# EAGLE design OOBD - BTM182 - V3 (EAGLE 5.11)
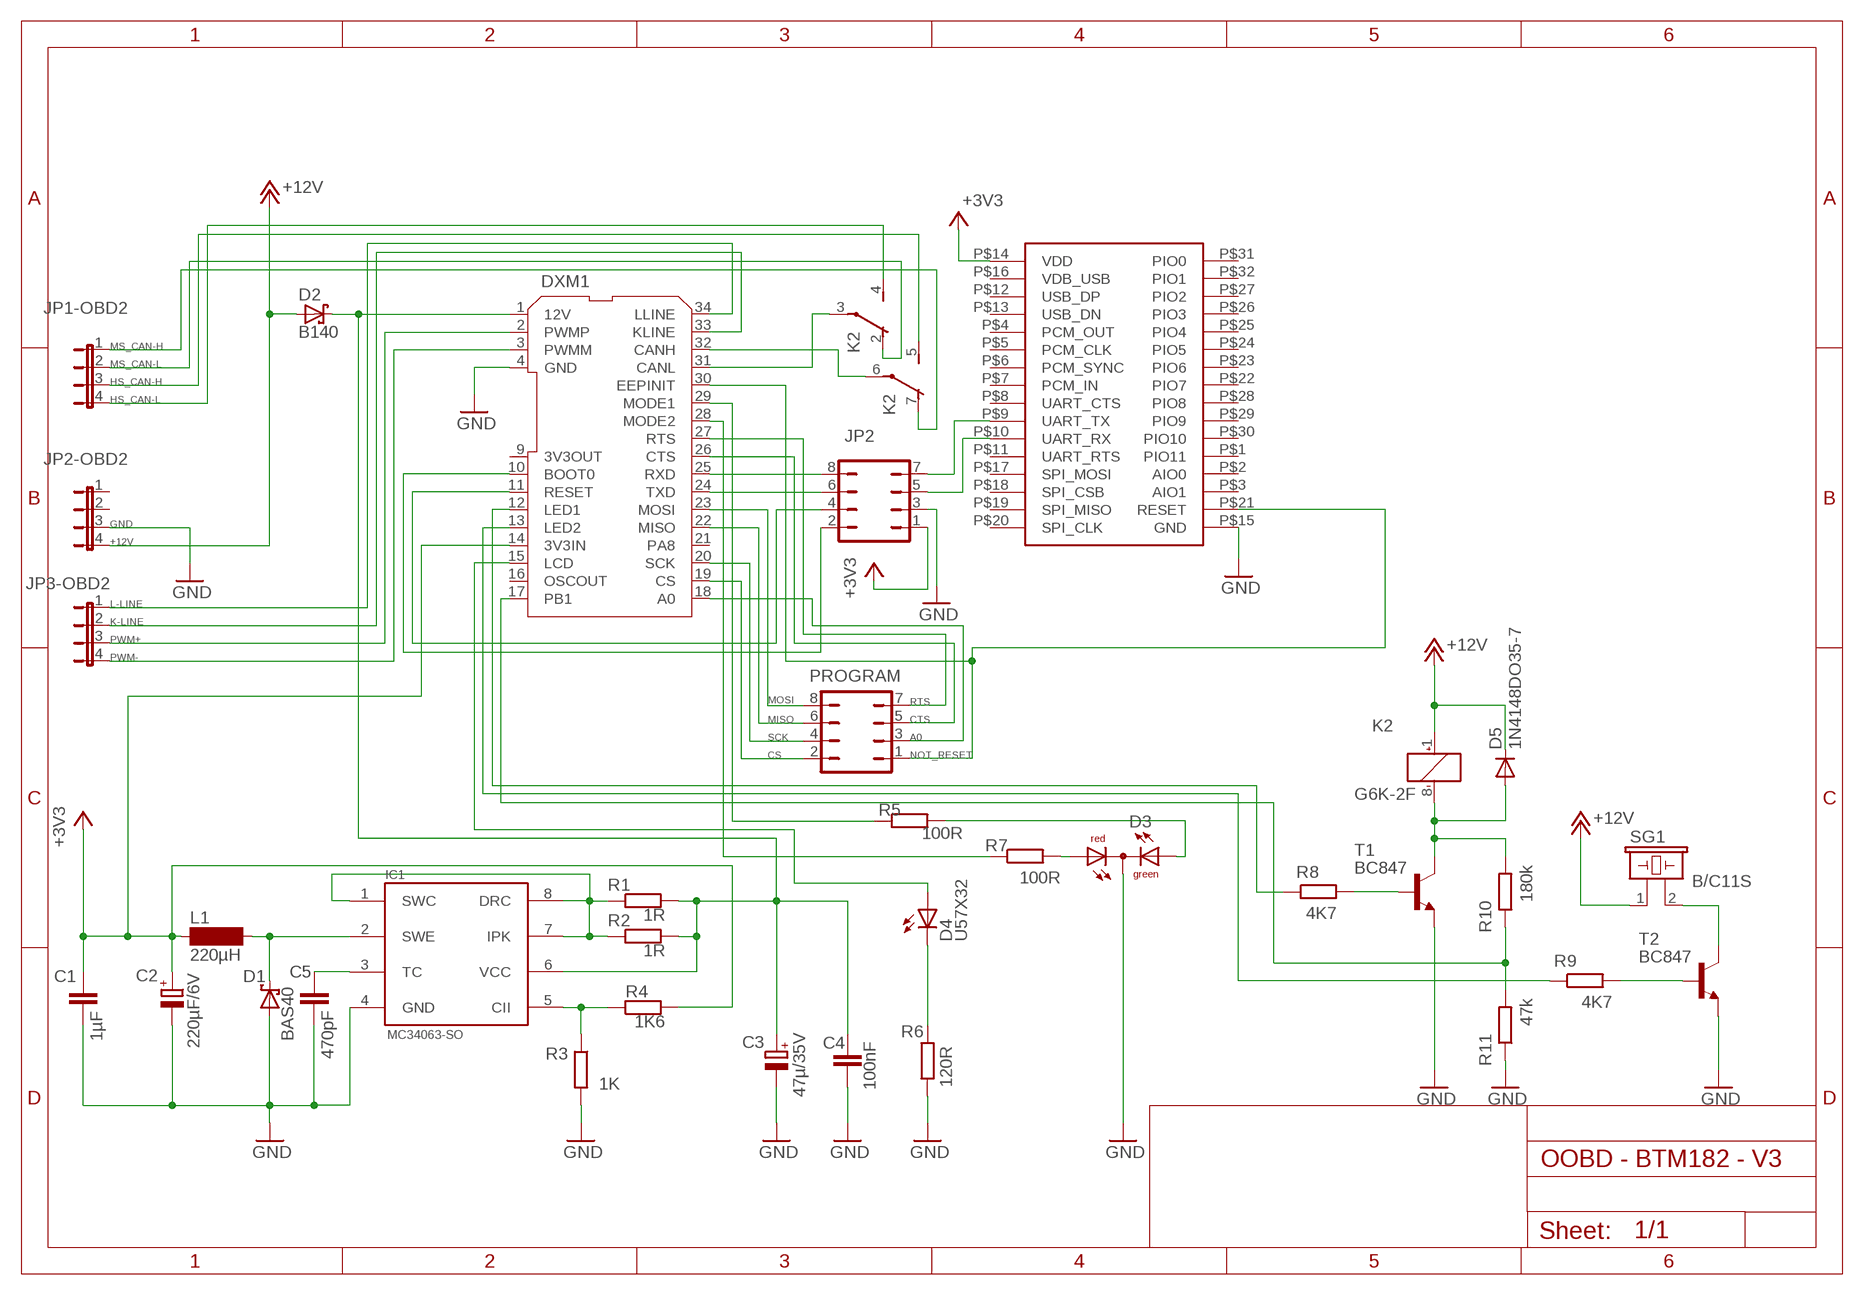
[diagram p0: schematic, sheet 1]

## Parts
BTM182  Bluetooth1  BTM182  [BTM182]
C1  1µF  C-EUC0603K  [C0603K]
C2  220µF/6V  CPOL-EUA/3216-18R  [A/3216-18R]
C3  47µ/35V  CPOL-EUA/3216-18R  [A/3216-18R]
C4  100nF  C-EUC0603K  [C0603K]
C5  470pF  C-EUC0603K  [C0603K]
D1  BAS40  [SOT23]
D2  B140  SCHOTTKY-DIODESMD  [SMB]
D3  DUOLED2X5  [DUOLED2X5]
D4  U57X32  LEDSQR5.7X3.2  [U57X32]
D5  1N4148DO35-7  DIODE-MICROMELF-W  [MICROMELF-W]
DXM1  DXM1-MINI  [DMX1-MINI]
IC1  MC34063-SO  [SO8]
JP1-OBD2  JP4E  [JP4]
JP2  JP4Q  [JP4Q]
JP2-OBD2  JP4E  [JP4]
JP3-OBD2  JP4E  [JP4]
K2  G6K-2F  [G6K-2F]
L1  220µH  SM-NE45  [SM-NE45]
PROGRAM  JP4Q  [JP4Q]
R1  1R  R-EU_R0603  [R0603]
R2  1R  R-EU_R0603  [R0603]
R3  1K  R-EU_R0603  [R0603]
R4  1K6  R-EU_R0603  [R0603]
R5  100R  R-EU_R0603  [R0603]
R6  120R  R-EU_R0603  [R0603]
R7  100R  R-EU_R0603  [R0603]
R8  4K7  R-EU_R0603  [R0603]
R9  4K7  R-EU_R0603  [R0603]
R10  180k  R-EU_R0603  [R0603]
R11  47k  R-EU_R0603  [R0603]
SG1  B/C11S  [B/C11S]
T1  BC847  [SOT23]
T2  BC847  [SOT23]

## Nets
+3V3: BTM182.P$14(VDD) C1.1 C2.+ DXM1.14(3V3IN) JP2.1 L1.1 R4.2
+12V: D2.A D5.C JP2-OBD2.4 K2.1(1:+) SG1.1
A0: DXM1.18(A0) PROGRAM.3
CS: DXM1.19(CS) PROGRAM.2
CTS: DXM1.26(CTS) PROGRAM.5
GND: BTM182.P$15(GND) C1.2 C2.- C3.- C4.2 C5.2 D1.1(A) D3.K(C) DXM1.4(GND) IC1.4(GND) JP2-OBD2.3 JP2.3 R3.2 R6.2 R11.1 T1.2(E) T2.2(E)
HS_CAN-H: JP1-OBD2.3 K2.5(3:S)
HS_CAN-L: JP1-OBD2.4 K2.4(2:S)
K-LINE: DXM1.33(KLINE) JP3-OBD2.2
L-LINE: DXM1.34(LLINE) JP3-OBD2.1
MISO: DXM1.22(MISO) PROGRAM.6
MOSI: DXM1.23(MOSI) PROGRAM.8
MS_CAN-H: JP1-OBD2.1 K2.7(3:O)
MS_CAN-L: JP1-OBD2.2 K2.2(2:O)
N$1: IC1.5(CII) R3.1 R4.1
N$2: C5.1 IC1.3(TC)
N$4: D3.AR R7.2
N$5: IC1.1(SWC) IC1.7(IPK) IC1.8(DRC) R1.1 R2.1
N$6: D3.AG R5.2
N$7: D4.K(C) R6.1
N$8: D4.A DXM1.15(LCD)
N$9: DXM1.29(MODE1) R5.1
N$10: DXM1.25(RXD) JP2.8
N$11: C3.+ C4.1 D2.C DXM1.1(12V) IC1.6(VCC) R1.2 R2.2
N$12: DXM1.24(TXD) JP2.6
N$14: BTM182.P$9(UART_TX) JP2.7
N$15: DXM1.28(MODE2) R7.1
N$16: DXM1.10(BOOT0) JP2.2
N$17: DXM1.11(RESET) JP2.4
N$19: DXM1.17(PB1) R10.1 R11.2
N$20: R8.2 T1.1(B)
N$21: DXM1.32(CANH) K2.6(3:P)
N$22: DXM1.31(CANL) K2.3(2:P)
N$23: SG1.2 T2.3(C)
N$24: R9.2 T2.1(B)
N$25: DXM1.12(LED1) R8.1
N$26: DXM1.13(LED2) R9.1
N$27: D5.A K2.8(1:-) R10.2 T1.3(C)
N$28: BTM182.P$10(UART_RX) JP2.5
N$29: D1.3(C) IC1.2(SWE) L1.2
NOT_RESET: BTM182.P$21(RESET) DXM1.30(EEPINIT) PROGRAM.1
PWM+: DXM1.2(PWMP) JP3-OBD2.3
PWM-: DXM1.3(PWMM) JP3-OBD2.4
RTS: DXM1.27(RTS) PROGRAM.7
SCK: DXM1.20(SCK) PROGRAM.4
Unconnected: BTM182.P$1(PIO11) BTM182.P$2(AIO0) BTM182.P$3(AIO1) BTM182.P$4(PCM_OUT) BTM182.P$5(PCM_CLK) BTM182.P$6(PCM_SYNC) BTM182.P$7(PCM_IN) BTM182.P$8(UART_CTS) BTM182.P$11(UART_RTS) BTM182.P$12(USB_DP) BTM182.P$13(USB_DN) BTM182.P$16(VDB_USB) BTM182.P$17(SPI_MOSI) BTM182.P$18(SPI_CSB) BTM182.P$19(SPI_MISO) BTM182.P$20(SPI_CLK) BTM182.P$22(PIO7) BTM182.P$23(PIO6) BTM182.P$24(PIO5) BTM182.P$25(PIO4) BTM182.P$26(PIO3) BTM182.P$27(PIO2) BTM182.P$28(PIO8) BTM182.P$29(PIO9) BTM182.P$30(PIO10) BTM182.P$31(PIO0) BTM182.P$32(PIO1) DXM1.16(OSCOUT) DXM1.21(PA8) JP2-OBD2.1 JP2-OBD2.2

## Power pins joined to a net without a drawn wire
3V3OUT: DXM1.9(3V3OUT)

## Library data of the parts
BTM182 = BTM182:BTM182
C1 C4 C5 = rcl:C-EU: CAPACITOR, European symbol
C2 C3 = rcl:CPOL-EU: POLARIZED CAPACITOR, European symbol
D1 = diode:BAS40: Silicon Schottky Diodes General-purpose diode for high-speed switching
D2 = diode:SCHOTTKY-DIODE: Schottky Diode
D3 = led:DUOLED2X5: DUO LED 2 colors, 2.5 x 5 mm, recangle
D4 = led:LED: LED OSRAM: - CHIPLED LG R971, LG N971, LY N971, LG Q971, LY Q971, LO R971, LY R971 LH N974, LH R974 LS Q976, LO Q976, LY Q976 LO Q996 - Hyper CHIPLED LW Q18S LB Q993, LB Q99A, LB R99A - SideLED LS A670, LO A670, LY A670, LG A670, LP A670 LB A673, LV A673, LT A673, LW A673 LH A674 LY A675 LS A676, LA A676, LO A676, LY A676, LW A676 LS A679, LY A679, LG A679 - Hyper Micro SIDELED® LS Y876, LA Y876, LO Y876, LY Y876 LT Y87S - SmartLED LW L88C, LW L88S LB L89C, LB L89S, LG L890 LS L89K, LO L89K, LY L89K LS L896, LA L896, LO L896, LY L896 - TOPLED LS T670, LO T670, LY T670, LG T670, LP T670 LSG T670, LSP T670, LSY T670, LOP T670, LYG T670 LG T671, LOG T671, LSG T671 LB T673, LV T673, LT T673, LW T673 LH T674 LS T676, LA T676, LO T676, LY T676, LB T676, LH T676, LSB T676, LW T676 LB T67C, LV T67C, LT T67C, LS T67K, LO T67K, LY T67K, LW E67C LS E67B, LA E67B, LO E67B, LY E67B, LB E67C, LV E67C, LT E67C LW T67C LS T679, LY T679, LG T679 LS T770, LO T770, LY T770, LG T770, LP T770 LB T773, LV T773, LT T773, LW T773 LH T774 LS E675, LA E675, LY E675, LS T675 LS T776, LA T776, LO T776, LY T776, LB T776 LHGB T686 LT T68C, LB T68C - Hyper Mini TOPLED® LB M676 - Mini TOPLED Santana® LG M470 LS M47K, LO M47K, LY M47K Source: http://www.osram.convergy.de LUXEON: - LUMILED® LXK2-PW12-R00, LXK2-PW12-S00, LXK2-PW14-U00, LXK2-PW14-V00 LXK2-PM12-R00, LXK2-PM12-S00, LXK2-PM14-U00 LXK2-PE12-Q00, LXK2-PE12-R00, LXK2-PE12-S00, LXK2-PE14-T00, LXK2-PE14-U00 LXK2-PB12-K00, LXK2-PB12-L00, LXK2-PB12-M00, LXK2-PB14-N00, LXK2-PB14-P00, LXK2-PB14-Q00 LXK2-PR12-L00, LXK2-PR12-M00, LXK2-PR14-Q00, LXK2-PR14-R00 LXK2-PD12-Q00, LXK2-PD12-R00, LXK2-PD12-S00 LXK2-PH12-R00, LXK2-PH12-S00 LXK2-PL12-P00, LXK2-PL12-Q00, LXK2-PL12-R00 Source: www.luxeon.com KINGBRIGHT: KA-3528ASYC Source: www.kingbright.com
D5 = diode:DIODE-: DIODE
DXM1 = DXM:DXM1-MINI
IC1 = mc34063:MC34063-SO: DC/DC converter MC34063 in SO08.
JP1-OBD2 JP2-OBD2 JP3-OBD2 = jumper:JP4E: JUMPER
JP2 PROGRAM = jumper:JP4Q: JUMPER
K2 = relay:G6K: Low Signal Relay oeiwcsnts1.omron.com/.. D20G6K0100.pdf; MF: OMRON COMPONENTS USA; MPN: G6K-2F DC24; OC_FARNELL: 1690427; OC_NEWARK: 36K7467
L1 = inductor-neosid:SM-NE45: INDUCTOR SMD chip inductor; OC_FARNELL: unknown; OC_NEWARK: unknown
R1-R11 = rcl:R-EU_: RESISTOR, European symbol
SG1 = buzzer:B/C11S: BUZZER Source: Buerklin; OC_FARNELL: unknown; OC_NEWARK: unknown
T1 T2 = transistor:BC847: NPN TRANSISTOR

## Board
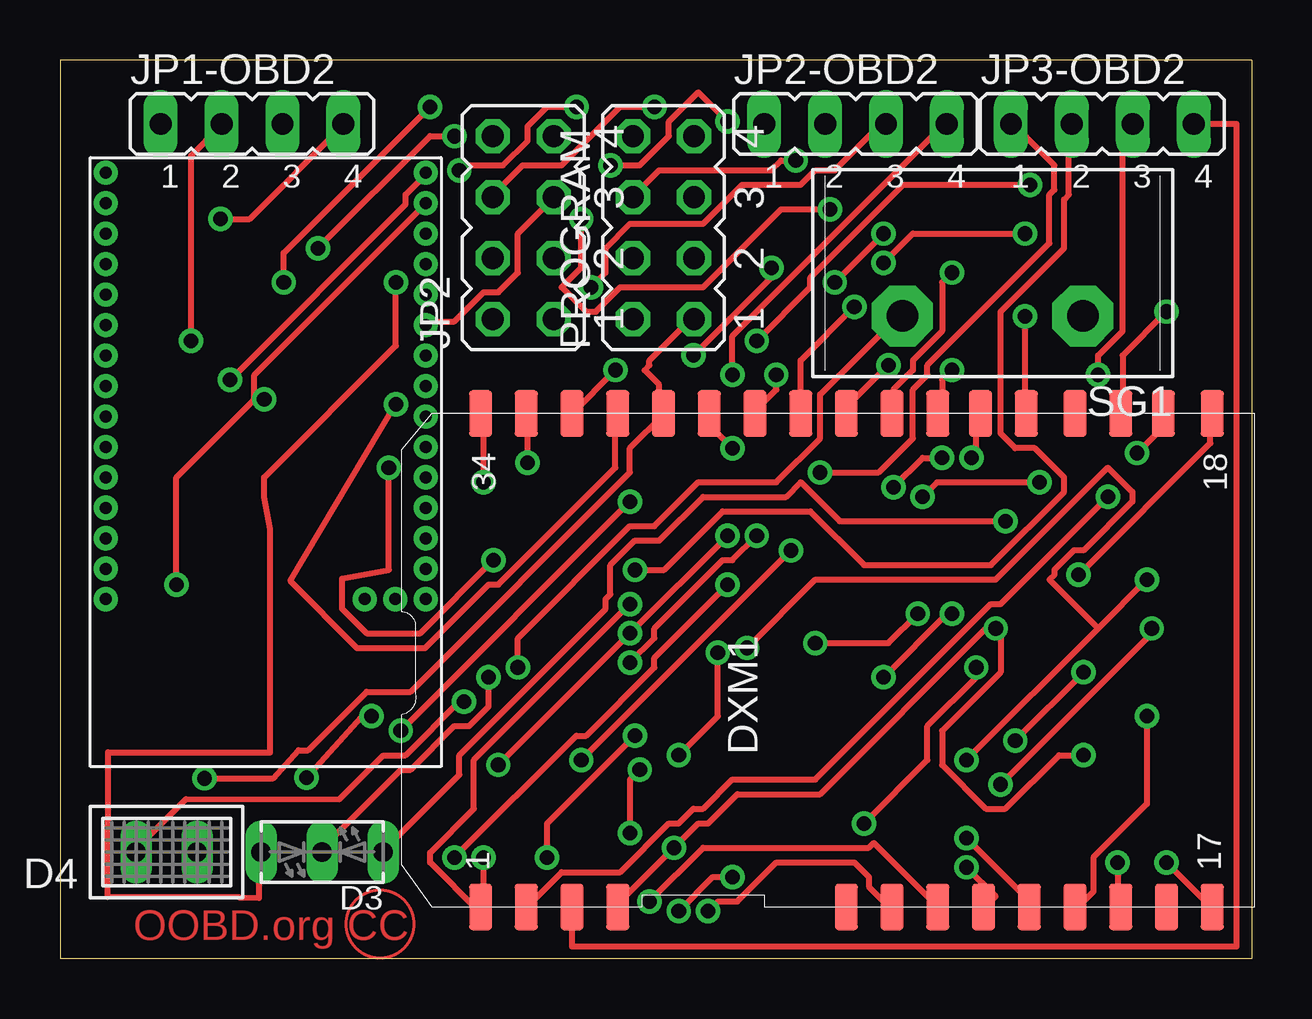
[diagram p1: board, top side]
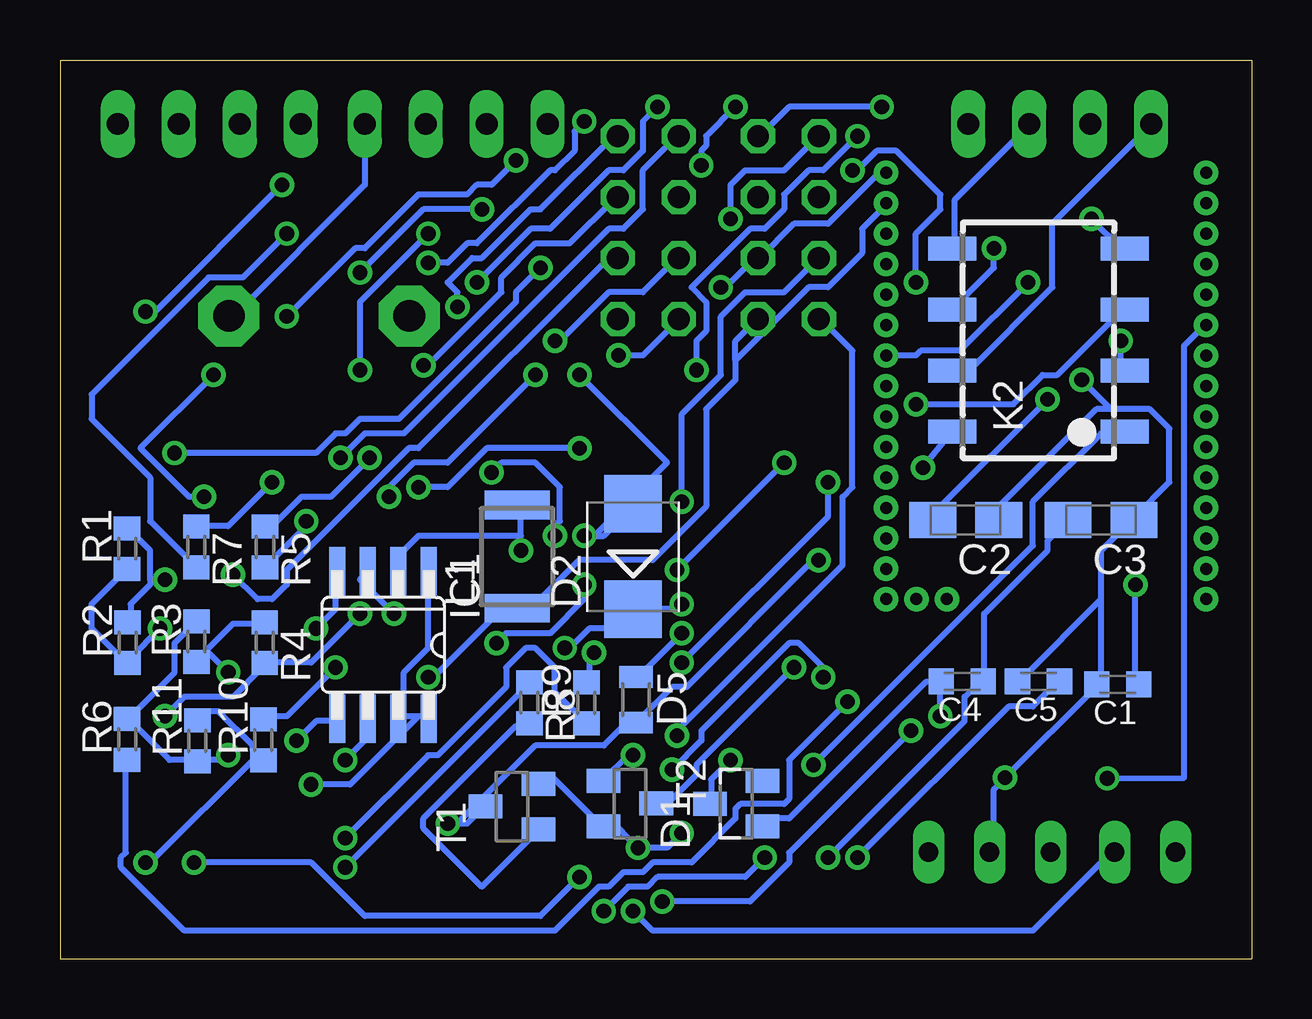
[diagram p2: board, bottom side, seen from below]

Size 49.66 x 37.47 mm. Coordinates in mm from the lower left corner, seen from the top.
Outline: 49.65,37.47 0,37.47 0,0 49.65,0
Outline: 49.66,37.45 49.66,0
Copper layers (1*16): Top 0.035mm / dielectric 1.5mm / Bottom 0.035mm
Design rules "default *": minimum track width 10mil, minimum drill 24mil, track to track 8mil, track to pad 8mil, pad to pad 8mil, via to via 8mil, smd to smd 8mil, copper to edge 40mil, drill to drill 8mil, minimum pad ring 10mil, minimum via ring 8mil, stop-mask expansion 4mil, vias tented up to drill 0mil, thermal gap 10mil

### Footprints (pad centres in the part's own frame; a part is rotated, then mirrored left to right if it is on the bottom)
BTM182 = drill 0.5 pad 0.813 round: P$1 6.985,-13.97; P$2 8.255,-13.97; P$3 9.525,-13.97; P$4 10.795,-13.97; P$5 12.065,-13.97; P$6 13.335,-13.97; P$7 14.605,-13.97; P$8 15.875,-13.97; P$9 17.145,-13.97; P$10 18.415,-13.97; P$11 19.685,-13.97; P$12 20.955,-13.97; P$13 22.225,-13.97; P$14 23.495,-13.97; P$15 24.765,-13.97; P$16 24.765,-0.635; P$17 23.495,-0.635; P$18 22.225,-0.635; P$19 20.955,-0.635; P$20 19.685,-0.635; P$21 18.415,-0.635; P$22 17.145,-0.635; P$23 15.875,-0.635; P$24 14.605,-0.635; P$25 13.335,-0.635; P$26 12.065,-0.635; P$27 10.795,-0.635; P$28 9.525,-0.635; P$29 8.255,-0.635; P$30 6.985,-0.635; P$31 6.985,-12.7; P$32 6.985,-11.43
C0603K = smd 1.05 x 1.08: 1 -0.875,0; 2 0.875,0
A/3216-18R = smd 1.95 x 1.5: + 1.375,0; - -1.375,0
SOT23 = smd 1 x 1.4: 1 -0.95,-1.1; 2 0.95,-1.1; 3 0,1.1
SMB = smd 2.4 x 2.4: A 2.2,0; C -2.2,0
DUOLED2X5 = drill 0.813 long: AG -2.54,0; AR 2.54,0; K 0,0
U57X32 = drill 0.813 long: A -1.27,0; K 1.27,0
MICROMELF-W = smd 0.9 x 1.4: A 0.95,0; C -0.95,0
DMX1-MINI = smd 1.93 x 0.965: 1 0,32.258; 2 0,30.353; 3 0,28.448; 4 0,26.543; 9 0,17.018; 10 0,15.113; 11 0,13.208; 12 0,11.303; 13 0,9.398; 14 0,7.493; 15 0,5.588; 16 0,3.683; 17 0,1.778; 18 20.574,1.778; 19 20.574,3.81; 20 20.574,5.588; 21 20.574,7.493; 22 20.574,9.525; 23 20.574,11.43; 24 20.574,13.208; 25 20.574,15.113; 26 20.574,17.018; 27 20.574,18.923; 28 20.574,20.828; 29 20.574,22.733; 30 20.574,24.638; 31 20.574,26.543; 32 20.574,28.448; 33 20.574,30.353; 34 20.574,32.258
SO8 = smd 0.66 x 2.032: 1 -1.905,-3.073; 2 -0.635,-3.073; 3 0.635,-3.073; 4 1.905,-3.073; 5 1.905,3.073; 6 0.635,3.073; 7 -0.635,3.073; 8 -1.905,3.073
JP4 = drill 0.914 long: 1 -3.81,0; 2 -1.27,0; 3 1.27,0; 4 3.81,0
JP4Q = drill 0.914 octagon: 1 -3.81,-1.27; 2 -3.81,1.27; 3 -1.27,-1.27; 4 -1.27,1.27; 5 1.27,-1.27; 6 1.27,1.27; 7 3.81,-1.27; 8 3.81,1.27
G6K-2F = smd 1 x 2: 1 -3.81,-3.6; 2 -1.27,-3.6; 3 1.27,-3.6; 4 3.81,-3.6; 5 3.81,3.6; 6 1.27,3.6; 7 -1.27,3.6; 8 -3.81,3.6
SM-NE45 = smd 1.2 x 2.7: 1 -2.15,0; 2 2.15,0
R0603 = smd 1 x 1.1: 1 -0.85,0; 2 0.85,0
B/C11S = drill 1.321 pad 2.54 octagon: 1 -3.759,0; 2 3.759,0

### Placement (x,y rotation side)
BTM182  1.27,8 90 top
C1  5.59,11.43 180 bottom
C2  11.92,18.29 180 bottom
C3  6.28,18.29 180 bottom
C4  12.07,11.56 180 bottom
C5  8.89,11.56 180 bottom
D1  21.48,6.46 90 bottom
D2  25.78,16.76 90 bottom
D3  10.92,4.45 180 top
D4  4.45,4.45 180 top
D5  25.65,10.8 270 bottom
DXM1  49.78,2.16 90 top
IC1  36.19,13.08 180 bottom
JP1-OBD2  8,34.8 0 top
JP2  19.3,30.48 90 top
JP2-OBD2  33.15,34.8 0 top
JP3-OBD2  43.43,34.8 0 top
K2  8.89,25.78 90 bottom
L1  30.61,16.76 90 bottom
PROGRAM  25.15,30.48 90 top
R1  46.86,17.09 90 bottom
R2  46.84,13.17 90 bottom
R3  43.97,13.21 90 bottom
R4  41.13,13.18 270 bottom
R5  41.12,17.16 270 bottom
R6  46.86,9.14 90 bottom
R7  43.98,17.16 270 bottom
R8  30.1,10.67 270 bottom
R9  27.72,10.67 90 bottom
R10  41.19,9.12 90 bottom
R11  43.94,9.08 90 bottom
SG1  38.86,26.8 180 top
T1  30.83,6.34 90 bottom
T2  25.91,6.47 270 bottom

### Tracks (layer width: path | path; a pad name or v marks a point on that pad's centre or on a via)
+3V3  (via drill 0.61)
  Top 0.254: v4.85,15.6 4.85,20.07 8.1,23.32 | 8.1,23.32 8.1,24.33 15.21,31.44 BTM182.P$14 | 8.1,23.32 v8.51,23.32 | v45.29,10.11 45.29,6.45 43.05,4.22 43.05,2.79 42.44,2.18 DXM1.14 | v37.16,14.38 36.96,14.38 v34.31,11.73
  Bottom 0.254: v4.85,15.6 4.85,11.53 C1.1 | v8.51,23.32 13.18,18.64 13.18,18.44 C2.+ | v45.29,10.11 44.47,10.92 42.44,10.92 41.22,12.14 R4.2 41.02,12.34 39.19,12.34 v37.16,14.38 | 21.51,24.94 21.51,25.76 20.7,26.57 JP2.1 | 21.51,24.94 21.51,24.13 22.73,22.91 22.73,18.85 24.97,16.61 28.02,16.61 29.85,14.78 30.46,14.78 L1.1 30.66,14.58 31.06,14.17 31.67,14.17 34.11,11.73 v34.31,11.73 | 21.51,24.94 18.47,27.99 17.65,27.99 16.23,29.41 16.23,30.43 15.42,31.24 15.42,31.44 BTM182.P$14
+12V  (via drill 0.61)
  Top 0.254: v27.81,17.63 v23.75,13.56 v18.26,8.08 | v28.02,24.33 28.02,25.96 36.75,34.7 36.96,34.7 JP2-OBD2.4
  Bottom 0.254: JP2-OBD2.4 36.96,32.26 42.44,26.77 SG1.1 | v23.75,13.56 25.38,11.94 25.58,11.94 D5.C | 27.41,17.63 27,17.63 25.78,18.85 D2.A | v18.26,8.08 9.12,17.22 9.12,19.05 6.27,21.9 5.46,21.9 K2.1 | v28.02,24.33 24.36,20.68 27.41,17.63 | v27.81,17.63 27.41,17.63
A0  (via drill 0.61)
  Top 0.254: v42.44,16 47.93,21.49 47.93,22.71 DXM1.18
  Bottom 0.254: v42.44,16 41.43,14.99 40.82,14.99 40.21,15.6 40.21,16.2 35.13,21.28 34.72,21.28 26.8,29.21 PROGRAM.3
CS  (via drill 0.61)
  Top 0.254: v44.88,21.08 45.9,22.1 45.9,22.71 DXM1.19 | v29.64,28.8 29.64,28.4 v26.39,25.15
  Bottom 0.254: v44.88,21.08 38.99,21.08 38.18,21.9 37.77,21.9 37.16,22.5 35.53,22.5 30.66,27.38 30.66,27.79 v29.64,28.8 | v26.39,25.15 25.38,25.15 23.95,26.57 PROGRAM.2
CTS  (via drill 0.61)
  Top 0.254: v34.52,24.74 32.89,23.11 32.89,22.91 DXM1.26
  Bottom 0.254: v34.52,24.74 34.31,24.74 31.27,27.79 31.27,28.4 29.85,29.82 28.42,29.82 26.59,31.65 PROGRAM.5
GND  (via drill 0.61)
  Top 0.254: DXM1.4 23.34,2.18 23.34,2.39 v25.58,4.62 26.59,5.64 27,5.64 28.22,6.86 31.67,6.86 38.58,13.77 v38.99,13.77 39.19,13.56 39.19,11.94 36.75,9.5 36.75,8.08 38.58,6.25 39.39,6.25 41.63,8.48 v42.65,8.48 | v22.12,27.99 22.73,28.6 22.73,29.62 23.75,30.63 26.8,30.63 28.42,32.26 30.86,32.26 31.47,32.87 32.28,32.87 34.11,34.7 34.31,34.7 JP2-OBD2.3 | v12.98,10.11 12.57,10.11 v10.27,7.55 | v7.09,24.13 14.4,31.44 14.4,31.85 15.21,32.66 BTM182.P$15 | v23.75,5.23 23.75,7.47 v24.16,7.87 | v17.86,11.73 17.86,10.52 17.04,9.7 16.43,9.7 14.61,7.87 14.2,7.87 10.95,4.62 D3.K
  Bottom 0.254: R3.2 44.07,13.97 44.88,13.16 44.88,11.94 46.71,10.11 R6.2 46.71,9.91 45.08,8.28 44.07,8.28 R11.1 43.87,8.28 42.85,8.28 v42.65,8.48 | T1.2 29.64,7.26 29.24,7.67 27.2,5.64 T2.2 27,5.64 26.8,5.84 v25.58,4.62 24.36,4.62 v23.75,5.23 | v38.99,13.77 38.18,14.58 38.18,16 IC1.4 | BTM182.P$15 15.42,32.66 15.62,32.66 17.65,30.63 19.07,30.63 20.5,29.21 JP2.3 20.7,29.21 21.92,27.99 v22.12,27.99 | 12.98,11.53 13.59,11.53 19.28,5.84 20.09,5.84 20.3,5.64 D1.1 | 6.27,14.99 6.27,17.02 5.05,18.24 C3.- 4.85,18.44 3.43,19.86 3.43,22.1 4.24,22.91 5.87,22.91 | 6.27,14.99 6.27,11.53 C1.2 6.48,11.33 v10.27,7.55 10.74,7.06 10.74,4.62 D3.K | 6.27,14.99 9.53,11.73 9.73,11.73 C5.2 | 5.87,22.91 6.48,22.91 10.54,18.85 10.54,18.44 C2.- | v12.98,10.11 12.98,11.53 | 12.98,11.53 C4.2 | 5.87,22.91 v7.09,24.13 | v24.16,7.87 22.94,9.09 22.94,9.5 19.28,13.16 18.87,13.16 17.65,11.94 v17.86,11.73
HS_CAN-H
  Bottom 0.254: K2.5 12.37,29.62 12.37,31.65 9.32,34.7 JP1-OBD2.3
HS_CAN-L  (via drill 0.61)
  Top 0.254: v6.68,30.84 7.9,30.84 11.76,34.7 JP1-OBD2.4
  Bottom 0.254: v6.68,30.84 5.46,29.62 K2.4
K-LINE  (via drill 0.61)
  Top 0.254: v19.48,20.68 19.48,22.71 DXM1.33 | v23.95,16.2 25.17,16.2 27.61,18.64 31.27,18.64 33.5,16.41 38.79,16.41 41.83,19.46 41.83,20.07 40.61,21.28 39.8,21.28 39.19,21.9 39.19,26.97 41.83,29.62 41.83,31.65 42.04,31.85 42.04,34.7 JP3-OBD2.2
  Bottom 0.254: v19.48,20.68 v23.95,16.2
L-LINE  (via drill 0.61)
  Top 0.254: v17.65,19.86 17.65,22.71 DXM1.34 | v23.75,12.34 24.77,13.36 24.77,13.77 27.61,16.61 28.02,16.61 v29.03,17.63 | v31.67,20.27 34.11,20.27 35.53,21.69 35.53,23.72 36.14,24.33 36.14,24.74 41.22,29.82 41.22,31.85 41.43,32.06 41.43,33.07 39.8,34.7 JP3-OBD2.1
  Bottom 0.254: v17.65,19.86 17.65,18.44 v23.75,12.34 | v29.03,17.63 29.03,18.03 28.83,18.24 28.83,19.66 29.85,20.68 31.27,20.68 v31.67,20.27
MISO  (via drill 0.61)
  Top 0.254: v40.21,26.77 40.21,22.91 DXM1.22 | v30.66,33.27 30.05,33.27 29.64,32.87 24.97,32.87 23.95,31.85 PROGRAM.6
  Bottom 0.254: v40.21,26.77 37.36,29.62 36.96,29.62 34.72,31.85 32.69,31.85 32.28,32.26 31.67,32.26 v30.66,33.27
MOSI  (via drill 0.61)
  Top 0.254: v37.97,20.88 38.18,21.08 38.18,22.71 DXM1.23
  Bottom 0.254: v37.97,20.88 36.96,21.9 35.33,21.9 26.8,30.43 26.19,30.43 25.38,31.24 25.38,32.87 23.95,34.29 PROGRAM.8
MS_CAN-H
  Bottom 0.254: K2.7 12.37,24.54 11.76,24.54 8.31,27.99 8.31,30.63 4.24,34.7 JP1-OBD2.1
MS_CAN-L  (via drill 0.61)
  Top 0.254: v5.46,25.76 5.46,33.48 6.68,34.7 JP1-OBD2.2
  Bottom 0.254: v5.46,25.76 5.46,24.54 K2.2
N$1  (via drill 0.61)
  Top 0.254: v39.8,9.09 v42.65,11.94
  Bottom 0.254: R4.1 41.22,13.97 42.44,13.97 43.87,12.55 R3.1 43.87,12.34 43.46,12.75 v42.65,11.94 | v39.8,9.09 38.99,9.91 38.18,9.91 IC1.5
N$2  (via drill 0.61)
  Top 0.254: v16.43,4.22 21.51,9.3 21.92,9.3 24.77,12.14 24.77,12.55 v27.81,15.6 | v31.47,13.16 34.52,13.16 v35.74,14.38
  Bottom 0.254: v16.43,4.22 10.13,10.52 9.12,10.52 8.1,11.53 C5.1 | v27.81,15.6 27.81,14.99 29.24,13.56 31.06,13.56 v31.47,13.16 | v35.74,14.38 37.16,15.8 36.96,16 IC1.3
N$4  (via drill 0.61)
  Top 0.254: v40.21,30.23 35.53,30.23 v34.31,29.01 | v27.81,34.9 26.59,36.12 25.38,34.9 25.38,34.29 24.16,33.07 v22.94,33.07 | v21.51,35.51 20.3,35.51 19.48,34.7 19.48,34.09 18.47,33.07 16.84,33.07 v16.64,32.87 | v14,28.19 14,25.55 8.51,20.07 8.51,19.25 8.75,17.91 8.75,8.6 2.01,8.61 1.99,2.57 7.48,2.55 8.3,2.53 8.31,4.42 D3.AR
  Bottom 0.254: v40.21,30.23 42.04,28.4 43.46,28.4 48.34,23.52 48.34,22.5 45.9,20.07 45.9,18.24 44.07,16.41 R7.2 | v34.31,29.01 33.5,29.01 32.69,29.82 32.28,29.82 29.24,32.87 29.03,32.87 28.22,33.68 28.22,34.49 v27.81,34.9 | v22.94,33.07 22.94,33.68 22.73,33.88 22.73,34.29 v21.51,35.51 | v16.64,32.87 16.43,32.87 15.62,33.68 14.81,33.68 12.98,31.85 12.98,31.24 14,30.23 v14,28.19
N$5  (via drill 0.61)
  Top 0.254: v45.49,13.77 45.49,13.56 v39.19,7.26
  Bottom 0.254: R1.1 46.91,16.2 48.34,14.78 48.34,13.77 46.91,12.34 R2.1 46.71,12.34 46.71,12.55 v45.49,13.77 | 35.33,10.11 35.53,10.11 IC1.7 35.33,10.11 | 34.72,10.11 35.33,10.11 | 34.72,10.11 34.31,10.11 IC1.8 | 35.33,10.11 35.33,11.94 34.31,12.95 34.31,16 IC1.1 | v39.19,7.26 37.57,7.26 34.72,10.11
N$6  (via drill 0.61)
  Top 0.254: v39.39,18.24 32.49,18.24 30.86,19.86 30.25,19.25 26.8,19.25 24.97,17.42 23.95,17.42 22.94,16.41 22.94,15.19 22.73,14.99 22.73,14.58 16.64,8.48 16.64,7.67 13.59,4.62 D3.AG
  Bottom 0.254: v39.39,18.24 39.39,18.03 41.02,16.41 R5.2
N$7  (via drill 0.61)
  Top 0.254: v16.84,10.72 16.64,10.72 14.4,8.48 13.47,8.47 11.64,6.65 5.26,6.66 3.23,4.62 D4.K
  Bottom 0.254: v16.84,10.72 19.28,8.28 19.28,6.66 19.48,6.45 21.31,6.45 21.51,6.25 21.51,5.84 23.34,4.01 24.97,4.01 25.38,3.61 26.19,3.61 26.8,3 27.2,3 29.03,1.17 44.47,1.17 47.12,3.81 47.12,4.22 46.91,4.42 46.91,8.28 R6.1
N$8  (via drill 0.61)
  Top 0.254: v44.07,4.01 44.07,2.18 DXM1.15 | v28.02,3.4 27.2,3.4 v25.78,1.98
  Bottom 0.254: v44.07,4.01 39.19,4.01 36.96,1.78 29.64,1.78 v28.02,3.4 | v25.78,1.98 24.97,1.17 9.12,1.17 5.87,4.42 D4.A
N$9  (via drill 0.61)
  Top 0.254: v36.75,20.88 35.94,20.88 v34.72,19.66 | v28.02,21.28 26.8,22.5 27,22.71 DXM1.29
  Bottom 0.254: v36.75,20.88 38.38,19.25 39.6,19.25 40.82,18.03 41.02,18.03 R5.1 | v34.72,19.66 33.5,19.66 31.88,21.28 v28.02,21.28
N$10  (via drill 0.61)
  Top 0.254: v37.16,28.6 36.75,28.19 36.75,26.16 35.53,24.94 35.53,24.54 34.72,23.72 34.72,22.91 DXM1.25 | v32.08,31.24 30.05,31.24 26.8,27.99 23.34,27.99 22.33,26.97 21.92,26.97 20.9,27.99 21.72,28.8 v21.72,30.84
  Bottom 0.254: v37.16,28.6 34.52,31.24 v32.08,31.24 | v21.72,30.84 21.72,32.26 21.11,32.87 19.48,32.87 18.06,34.29 JP2.8
N$11  (via drill 0.61)
  Top 0.254: 43.26,13.77 v45.29,15.8 | 43.26,13.77 v37.77,8.28 | v17.65,4.22 17.65,2.18 DXM1.1 17.45,1.98 15.42,4.01 15.42,4.42 17.25,6.25 17.25,8.28 v23.75,14.78 | 43.26,13.77 41.22,15.8 41.43,16 41.43,16.2 42.24,17.02 42.65,17.02 44.68,19.05 44.68,19.46 43.66,20.47 38.99,15.8 31.47,15.8 v28.63,12.95
  Bottom 0.254: 45.9,15.8 45.9,17.02 46.71,17.83 R1.2 | 45.9,15.8 45.9,15.6 46.71,14.78 46.71,14.17 R2.2 | v37.77,8.28 36.96,9.09 36.96,9.91 IC1.6 | v45.29,15.8 45.9,15.8 | C3.+ 7.7,18.24 8.51,17.42 8.51,17.02 11.15,14.38 11.15,11.73 C4.1 11.35,11.53 11.96,10.92 11.96,9.91 v17.65,4.22 | v23.75,14.78 23.95,14.58 25.78,14.58 D2.C 25.78,14.38 26.39,13.77 27.61,13.77 28.42,12.95 v28.63,12.95
N$12  (via drill 0.61)
  Top 0.254: v37.16,24.54 36.75,24.13 36.75,22.91 DXM1.24 | v32.28,28.19 v34.31,30.23 | v24.77,35.51 23.34,35.51 20.9,33.07 19.28,33.07 18.06,31.85 JP2.6
  Bottom 0.254: v37.16,24.54 37.16,27.38 v34.31,30.23 | v32.28,28.19 30.05,30.43 29.24,30.43 26.8,32.87 26.19,32.87 25.38,33.68 25.38,34.9 v24.77,35.51
N$14  (via drill 0.61)
  Top 0.254: v9.32,28.19 9.32,29.41 v15.42,35.51
  Bottom 0.254: v9.32,28.19 12.17,25.35 13.79,25.35 14,25.15 BTM182.P$9 | v15.42,35.51 19.28,35.51 20.5,34.29 JP2.7
N$15  (via drill 0.61)
  Top 0.254: v40.82,19.86 36.55,19.86 v35.94,19.25 | v29.85,24.33 29.85,23.72 29.03,22.91 DXM1.28
  Bottom 0.254: v40.82,19.86 42.65,18.03 43.87,18.03 R7.1 | v35.94,19.25 35.94,19.66 34.92,20.68 33.5,20.68 v29.85,24.33
N$16  (via drill 0.61)
  Top 0.254: v27,1.98 27.41,2.39 28.22,2.39 29.85,4.01 33.1,4.01 33.71,3.4 33.71,3 34.52,2.18 DXM1.10 | v20.3,4.22 20.3,5.64 v23.95,9.3
  Bottom 0.254: v27,1.98 25.98,3 25.17,3 24.77,3.4 21.11,3.4 v20.3,4.22 | v23.95,9.3 23.95,9.5 17.04,16.41 17.04,19.25 16.64,19.66 16.64,25.35 17.86,26.57 JP2.2
N$17  (via drill 0.61)
  Top 0.254: v24.56,2.39 26.8,4.62 33.71,4.62 33.91,4.83 DXM1.11 | v14.2,9.5 v23.75,19.05
  Bottom 0.254: v24.56,2.39 20.9,2.39 19.28,4.01 19.28,4.42 v14.2,9.5 | v23.75,19.05 23.75,22.71 22.12,24.33 22.12,26.77 21.11,27.79 19.48,27.79 18.06,29.21 JP2.4
N$19  (via drill 0.61)
  Top 0.254: v46.1,4.01 47.93,2.18 DXM1.17
  Bottom 0.254: 41.43,8.48 41.63,8.69 41.63,8.89 43.05,10.31 43.66,10.31 43.87,10.11 R11.2 | 41.43,8.48 41.22,8.28 R10.1 41.43,8.48 | v46.1,4.01 45.9,4.01 41.43,8.48
N$20
  Bottom 0.254: R8.2 30.25,9.7 30.66,9.7 34.52,5.84 34.52,5.44 32.08,3 29.85,5.23 T1.1
N$21  (via drill 0.61)
  Top 0.254: v16.43,34.29 15.42,34.29 v10.74,29.62 | v23.14,24.54 DXM1.32
  Bottom 0.254: v23.14,24.54 23.14,25.76 22.73,26.16 22.73,27.38 23.34,27.99 20.9,30.43 20.3,30.43 19.48,31.24 19.48,31.85 18.47,32.87 17.86,32.87 v16.43,34.29 | v10.74,29.62 10.74,28.8 12.37,27.18 K2.6
N$22  (via drill 0.61)
  Top 0.254: v14,23.11 9.6,15.75 12.37,12.95 15.21,12.95 17.86,15.6 18.26,15.6 23.14,20.47 23.14,22.71 DXM1.31
  Bottom 0.254: v14,23.11 9.93,23.11 8.71,24.33 8.1,24.33 5.46,26.97 K2.3
N$23  (via drill 0.61)
  Top 0.254: v19.07,12.14 19.07,13.36 23.75,18.03 24.77,18.03 26.59,19.86 29.85,19.86 31.67,21.69 31.67,23.52 34.92,26.77 SG1.2
  Bottom 0.254: v19.07,12.14 23.14,8.08 23.14,7.67 24.16,6.66 24.77,6.66 T2.3
N$24  (via drill 0.61)
  Top 0.254: v27.41,12.75 27.41,10.11 v25.78,8.48
  Bottom 0.254: v27.41,12.75 27.61,12.55 27.61,11.53 R9.2 | v25.78,8.48 25.98,8.48 27,7.47 T2.1
N$25  (via drill 0.61)
  Top 0.254: v37.77,3.81 38.99,2.59 38.58,2.18 DXM1.12
  Bottom 0.254: v37.77,3.81 30.25,11.33 R8.1
N$26  (via drill 0.61)
  Top 0.254: v37.77,5.03 40.41,2.39 40.21,2.18 DXM1.13
  Bottom 0.254: v37.77,5.03 34.31,8.48 33.91,8.48 31.06,11.33 31.06,12.14 30.25,12.95 29.85,12.95 29.03,12.14 29.03,11.12 27.81,9.91 R9.1
N$27  (via drill 0.61)
  Top 0.254: v38.18,12.14 38.18,11.73 36.14,9.7 36.14,8.28 v33.5,5.64 | v13.7,20.47 13.7,16.2 11.76,15.85 11.76,14.58 12.78,13.56 15.01,13.56 v18.06,16.61
  Bottom 0.254: v38.18,12.14 40.21,10.11 41.02,10.11 R10.2 | 33.1,5.64 32.69,5.64 32.08,6.25 T1.3 | 33.1,5.64 29.85,8.89 27,8.89 26.19,9.7 25.78,9.7 D5.A 25.58,9.91 24.16,11.33 23.55,11.33 18.26,16.61 v18.06,16.61 | 33.1,5.64 v33.5,5.64 | v13.7,20.47 12.57,21.9 K2.8
N$28
  Top 0.254: BTM182.P$10 15.42,26.57 16.43,26.57 17.65,27.79 18.26,27.79 19.07,28.6 19.07,30.23 20.5,31.65 JP2.5
N$29  (via drill 0.61)
  Top 0.254: v21.72,8.28 v30.46,17.02
  Bottom 0.254: v21.72,8.28 22.53,7.47 22.53,6.66 D1.3 | 30.46,17.63 30.46,18.85 L1.2 | v30.46,17.02 30.46,17.63 | 30.46,17.63 34.72,17.63 35.53,16.81 35.53,16.2 IC1.2
NOT_RESET  (via drill 0.61)
  Top 0.254: PROGRAM.1 26.39,26.77 24.56,24.94 24.56,24.74 24.36,24.54 24.97,23.93 24.97,22.91 DXM1.30 25.17,22.71 23.75,21.28 23.75,20.27 14.61,11.12 12.78,11.12 10.34,8.69 9.93,8.69 8.89,7.52 v6.02,7.52
  Bottom 0.254: v6.02,7.52 2.82,7.54 2.82,25.55 2.01,26.36 BTM182.P$21
PWM+  (via drill 0.61)
  Top 0.254: v43.66,19.25 39.19,14.78 38.79,14.78 31.47,7.47 28.02,7.47 26.8,6.25 26.39,6.25 25.78,5.64 25.38,5.64 23.34,3.61 20.9,3.61 19.48,2.18 DXM1.2 | v43.26,24.33 43.26,25.15 44.27,26.16 44.27,34.29 44.68,34.7 JP3-OBD2.3
  Bottom 0.254: v43.66,19.25 44.27,19.25 46.3,21.28 v43.26,24.33
PWM-
  Top 0.254: JP3-OBD2.4 49.02,34.8 49.02,0.51 21.34,0.51 DXM1.3
RTS  (via drill 0.61)
  Top 0.254: v33.1,27.18 30.86,24.94 DXM1.27
  Bottom 0.254: v33.1,27.18 33.1,27.79 33.5,28.19 32.49,29.21 32.08,29.21 30.05,31.24 29.64,31.24 26.59,34.29 PROGRAM.7
SCK  (via drill 0.61)
  Top 0.254: v46.1,26.97 44.27,25.15 44.27,22.91 DXM1.20 | v40.41,32.26 35.13,32.26 31.27,28.4 31.27,27.99 v29.03,25.76
  Bottom 0.254: v46.1,26.97 45.69,26.97 v40.41,32.26 | v29.03,25.76 28.83,25.76 26.8,27.79 25.38,27.79 23.95,29.21 PROGRAM.4
(copper drawn outside any net)
  shapes: Top circle x1

### Text on the board
Top: OOBD.org CC